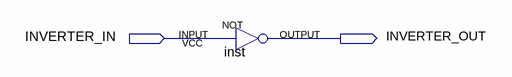
[diagram p0: schematic sheet]
// Quartus schematic INVERTER.bdf as structural Verilog: 1 symbols, 2 pins
module INVERTER (
  input  INVERTER_IN,
  output INVERTER_OUT
);

  not inst (INVERTER_OUT, INVERTER_IN);
endmodule
